# Altium schematic sheet DrudePower.SchDoc
size Letter
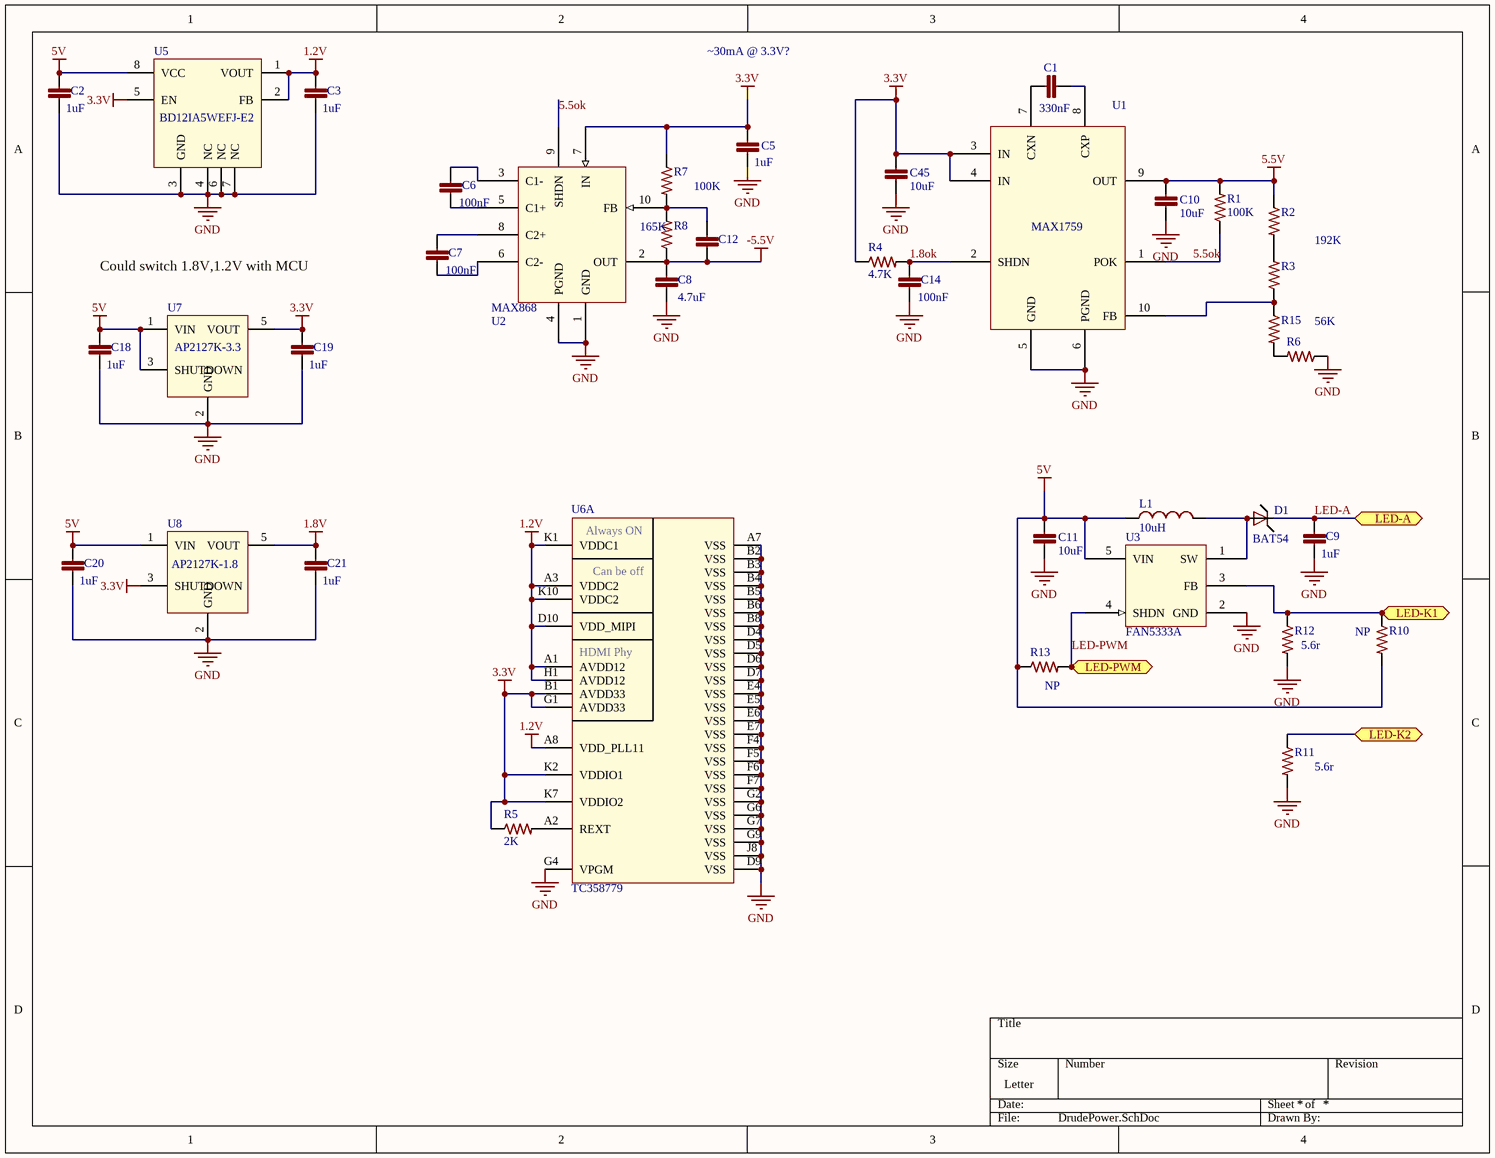
[diagram p0: DrudePower.SchDoc]

## Parts
C1  330nF  [C0603]
C2  1uF  [C0603]
C3  1uF  [C0603]
C5  1uF  [C0603]
C6  100nF  [C0603]
C7  100nF  [C0603]
C8  4.7uF  [C1206]
C9  1uF  [C0805]
C10  10uF  [C0805]
C11  10uF  [C0805]
C12  (no value)  [C0603]
C14  100nF  [C0603]
C18  1uF  [C0603]
C19  1uF  [C0603]
C20  1uF  [C0603]
C21  1uF  [C0603]
C45  10uF  [C0805]
D1  BAT54  [SOD523]
L1  10uH  [INDP3027X15L]
R1  100K  [R0603]
R2  (no value)  [R0603]
R3  (no value)  [R0603]
R4  4.7K  [R0603]
R5  2K  [R0402]
R6  (no value)  [R0603]
R7  (no value)  [R0603]
R8  (no value)  [R0603]
R10  (no value)  [R0603]
R11  (no value)  [R0603]
R12  (no value)  [R0603]
R13  (no value)  [R0603]
R15  (no value)  [R0603]
U1  MAX1759  [TSSOP50P490X109-10L]
U2  MAX868  [TSSOP50P490X109-10L]
U3  FAN5333A  [SOT95P270X145-5L]
U5  BD12IA5WEFJ-E2  [TSOP-HTSOP-J8-127P600X100_HS-9M]
U6  TC358779  [BGA80-0707-065]  (part A of 2)
U7  AP2127K-3.3  [SOT23-5P285X140-5L]
U8  AP2127K-1.8  [SOT23-5P285X140-5L]

## Ports
LED-A, LED-K1, LED-K2, LED-PWM

## Nets
1.2V: C3.1 U5.1(VOUT) U5.2(FB) U6.A1(AVDD12) U6.A3(VDDC2) U6.A8(VDD_PLL11) U6.D10(VDD_MIPI) U6.H1(AVDD12) U6.K1(VDDC1) U6.K10(VDDC2)
1.8V: C21.1 U8.5(VOUT)
3.3V: C5.1 C19.1 C45.1 R4.1 R5.1 R7.1 U1.3(IN) U1.4(IN) U2.7(IN) U5.5(EN) U6.B1(AVDD33) U6.G1(AVDD33) U6.K2(VDDIO1) U6.K7(VDDIO2) U7.5(VOUT) U8.3(SHUTDOWN)
5.5V: C10.1 R1.2 R2.1 U1.9(OUT)
5V: C2.1 C11.1 C18.1 C20.1 L1.1 R10.2 R13.1 U3.5(VIN) U5.8(VCC) U7.1(VIN) U7.3(SHUTDOWN) U8.1(VIN)
-5.5V: C8.1 C12.2 R8.1 U2.2(OUT)
GND: C2.2 C3.2 C5.2 C8.2 C9.2 C10.2 C11.2 C14.2 C18.2 C19.2 C20.2 C21.2 C45.2 R6.1 R11.2 R12.2 U1.5(GND) U1.6(PGND) U2.1(GND) U2.4(PGND) U3.2(GND) U5.3(GND) U5.4(NC) U5.6(NC) U5.7(NC) U6.A7(VSS) U6.B2(VSS) U6.B3(VSS) U6.B4(VSS) U6.B5(VSS) U6.B6(VSS) U6.B8(VSS) U6.D4(VSS) U6.D5(VSS) U6.D6(VSS) U6.D7(VSS) U6.D9(VSS) U6.E4(VSS) U6.E5(VSS) U6.E6(VSS) U6.E7(VSS) U6.F4(VSS) U6.F5(VSS) U6.F6(VSS) U6.F7(VSS) U6.G2(VSS) U6.G4(VPGM) U6.G6(VSS) U6.G7(VSS) U6.G9(VSS) U6.J8(VSS) U7.2(GND) U8.2(GND)
1.8ok: C14.1 R4.2 U1.2(SHDN)
5.5ok: R1.1 U1.1(POK) U2.9(SHDN)
LED-A: C9.1 D1.C ; port LED-A
LED-K1: R10.1 R12.1 U3.3(FB) ; port LED-K1
LED-K2: R11.1 ; port LED-K2
LED-PWM: R13.2 U3.4(SHDN) ; port LED-PWM
NetC1_1: C1.1 U1.7(CXN)
NetC1_2: C1.2 U1.8(CXP)
NetC6_1: C6.1 U2.3(C1-)
NetC6_2: C6.2 U2.5(C1+)
NetC7_1: C7.1 U2.8(C2+)
NetC7_2: C7.2 U2.6(C2-)
NetC12_1: C12.1 R7.2 R8.2 U2.10(FB)
NetD1_A: D1.A L1.2 U3.1(SW)
NetR2_2: R2.2 R3.2
NetR3_1: R3.1 R15.1 U1.10(FB)
NetR5_2: R5.2 U6.A2(REXT)
NetR6_2: R6.2 R15.2

## Notes on the sheet
- ~30mA @ 3.3V?
- (near R8) 165K
- 100K
- Could switch 1.8V,1.2V with MCU
- 192K
- 56K
- (near R10) NP
- (near R13) NP
- (near R12) 5.6r
- (near R11) 5.6r
- (in symbol TC358779, part A) Always ON; Can be off; HDMI Phy

## Library data of the parts
C1 = C1608X7R1H334K080AC: CAP CER 0603 330nF 50V 10% X7R; LastRevisionNote: ImportComponents; Published: 23-Apr-2014; Publisher: UltiMachine; LastRevisionDate: 23-Apr-2014; ManufacturerPartNumber: C1608X7R1H334K080AC; VALUE: 330nF
C2 C3 C5 C18-C21 = CC0603ZRY5V6BB105: CAP CER 0603 1uF 10V Y5V; LastRevisionNote: ImportComponents; Published: 23-Apr-2014; Publisher: UltiMachine; LastRevisionDate: 23-Apr-2014; ManufacturerPartNumber: CC0603ZRY5V6BB105; VALUE: 1uF
C6 C7 C14 = C0603C104K5RACTU: CAP CER 0603 100nF 50V 10% X7R; LastRevisionNote: ImportComponents; Published: 23-Apr-2014; Publisher: UltiMachine; LastRevisionDate: 23-Apr-2014; ManufacturerPartNumber: C0603C104K5RACTU; VALUE: 100nF
C8 = GRM31CR71H475KA12L: CAP CER 1206 4.7uF 50V 10% X7R; LastRevisionNote: ImportComponents; Published: 23-Apr-2014; Publisher: UltiMachine; LastRevisionDate: 23-Apr-2014; ManufacturerPartNumber: GRM31CR71H475KA12L; VALUE: 4.7uF
C9 = GRM21BR71H105KA12L: CAP CER 0805 1uF 50V 10% X7R; LastRevisionNote: ImportComponents; Published: 23-Apr-2014; Publisher: UltiMachine; LastRevisionDate: 23-Apr-2014; ManufacturerPartNumber: GRM21BR71H105KA12L; VALUE: 1uF
C10 C11 C45 = C0805C106K8PACTU: CAP CER 0805 10uF 10V 10% X5R; LastRevisionNote: ImportComponents; Published: 23-Apr-2014; Publisher: UltiMachine; LastRevisionDate: 23-Apr-2014; ManufacturerPartNumber: C0805C106K8PACTU; VALUE: 10uF
C12 = Capacitor: Capacitor Non Polarized; LastRevisionNote: ImportComponents; Published: 23-Apr-2014; Publisher: UltiMachine; LastRevisionDate: 23-Apr-2014
D1 = BAT54XV2: Diode Schottky 30V 200mA
L1 = SRN3015-100M: Ind 10uH 1A
R1 = RC0603FR-07100KL: RES 100K OHM 1/10W 1% 0603 SMD; LastRevisionNote: ImportComponents; Published: 23-Apr-2014; Publisher: UltiMachine; LastRevisionDate: 23-Apr-2014; ManufacturerPartNumber: RC0603FR-07100KL; VALUE: 100K
R2 R3 R6-R8 R10-R13 R15 = Resistor: LastRevisionNote: ImportComponents; Published: 23-Apr-2014; Publisher: UltiMachine; LastRevisionDate: 23-Apr-2014
R4 = ERJ3EKF4701V: RES 0603 4.7K 100mW 1%; LastRevisionNote: ImportComponents; Published: 23-Apr-2014; Publisher: UltiMachine; LastRevisionDate: 23-Apr-2014; ManufacturerPartNumber: ERJ3EKF4701V; VALUE: 4.7K
R5 = RC0402FR-072KL: RES SMD 2K OHM 1% 1/16W 0402; ManufacturerPartNumber: RC0402FR-0710KP; LastRevisionNote: ImportComponents; Published: 23-Apr-2014; Publisher: UltiMachine; LastRevisionDate: 23-Apr-2014; VALUE: 2K
U1 = MAX1759: Buck/Boost Regulating Charge Pump
U2 = MAX868: Regulated -2x Inverting Charge Pump
U3 = FAN5333: LED Driver w/ integrated switch
U5 = BD12IA5WEFJ-E2: LDO Regulator 500mA 1.2V
U7 = AP2127K-3.3TRG1: LDO 3.3V 0.3A SOT25
U8 = AP2127K-1.8TRG1: LDO 1.8V 0.3A SOT25